# EAGLE design IoTKitV3th_small (EAGLE 9.5.2)
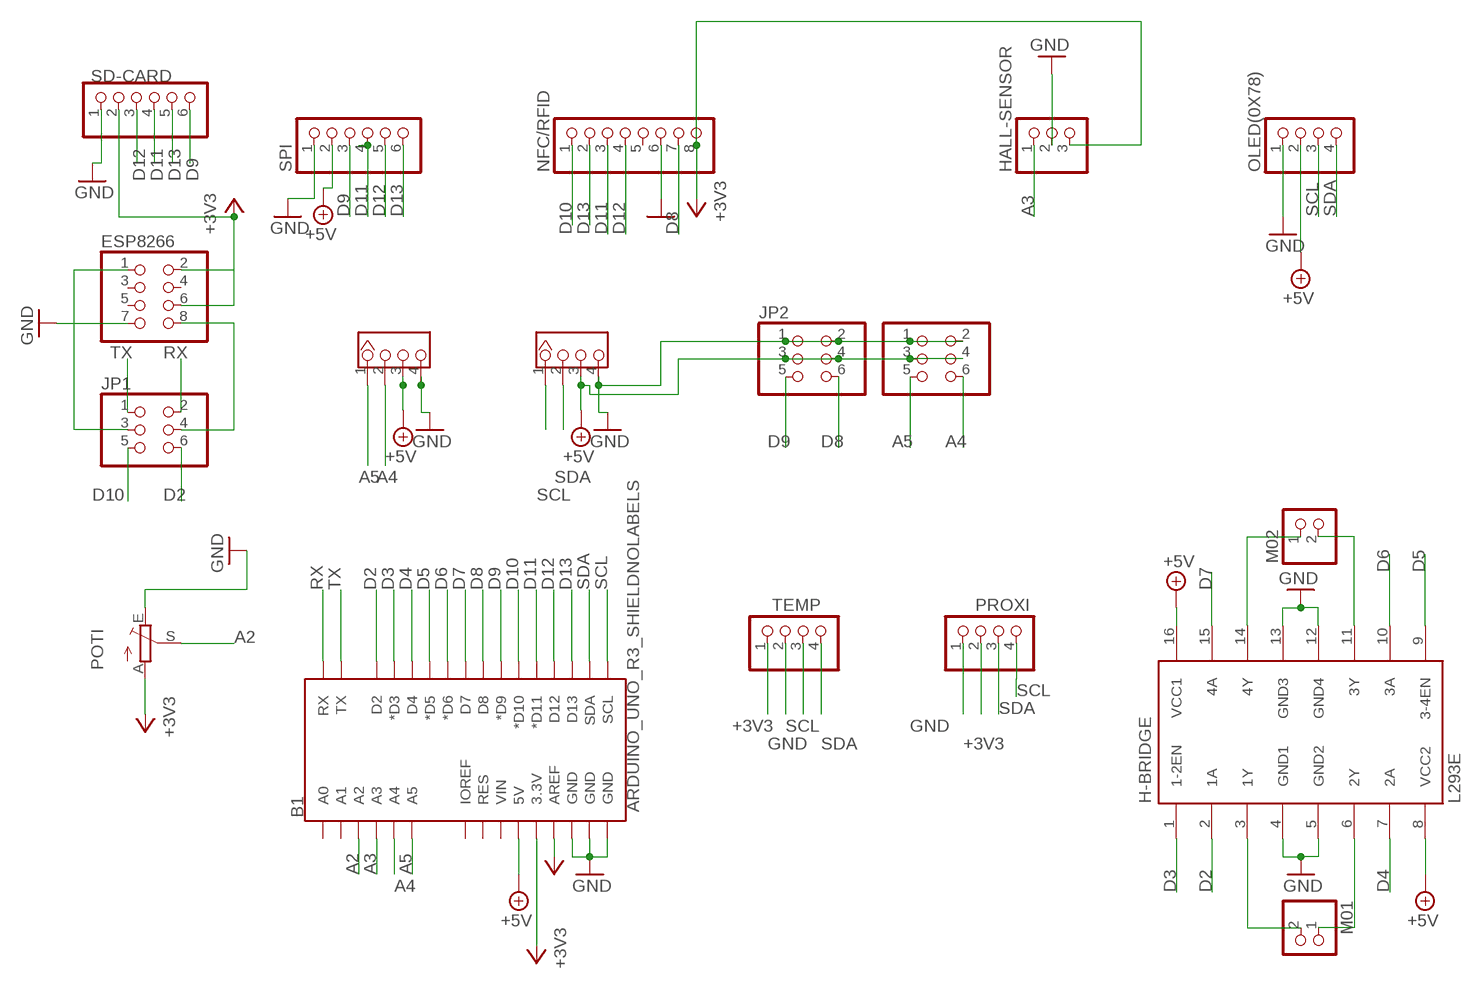
[diagram p0: schematic, sheet 1]

## Parts
B1  ARDUINO_UNO_R3_SHIELDNOLABELS  [UNO_R3_SHIELD_NOLABELS]
ESP8266  PINHD-2X4  [2X04]
H-BRIDGE  L293E  [DIL16]
HALL-SENSOR  PINHD-1X3  [1X03]
I2C  4P-2.0  GROVE-CONNECTOR-DIP(4P-2.0)  [HW4-2.0]
I2C1  I2C  GROVE-CONNECTOR-DIP(4P-2.0)  [HW4-2.0]
JP1  PINHD-2X3  [2X03]
JP2  PINHD-2X3  [2X03]
JP3  PINHD-2X3  [2X03]
M01  PINHD-1X2  [1X02]
M02  PINHD-1X2  [1X02]
NFC/RFID  PINHD-1X8  [1X08]
OLED(0X78)  PINHD-1X4  [1X04]
POTI  TRIM_EU-B25P  [B25P]
PROXI  PINHD-1X4  [1X04]
SD-CARD  PINHD-1X6  [1X06]
SPI  PINHD-1X6  [1X06]
TEMP  TEMP  PINHD-1X4  [1X04]

## Nets
+3V3: B1.3.3V B1.AREF ESP8266.2 ESP8266.6 HALL-SENSOR.3 NFC/RFID.8 POTI.A PROXI.2 SD-CARD.2 TEMP.1
+5V: B1.5V H-BRIDGE.8(VCC2) H-BRIDGE.16(VCC1) I2C1.3 I2C.3 JP2.3 JP2.4 JP3.3 JP3.4 OLED(0X78).2 SPI.2
A2: B1.A2 POTI.S
A3: B1.A3 HALL-SENSOR.1
A4: B1.A4 I2C.2 JP3.6
A5: B1.A5 I2C.1 JP3.5
D2: B1.D2 H-BRIDGE.2(1A) JP1.6
D3: B1.D3(*D3) H-BRIDGE.1(1-2EN)
D4: B1.D4 H-BRIDGE.7(2A)
D5: B1.D5(*D5) H-BRIDGE.9(3-4EN)
D6: B1.D6(*D6) H-BRIDGE.10(3A)
D7: B1.D7 H-BRIDGE.15(4A)
D8: B1.D8 JP2.6 NFC/RFID.7
D9: B1.D9(*D9) JP2.5 SD-CARD.6 SPI.3
D10: B1.D10(*D10) JP1.5 NFC/RFID.1
D11: B1.D11(*D11) NFC/RFID.3 SD-CARD.4 SPI.4
D12: B1.D12 NFC/RFID.4 SD-CARD.3 SPI.5
D13: B1.D13 NFC/RFID.2 SD-CARD.5 SPI.6
GND: B1.GND@0(GND) B1.GND@1(GND) B1.GND@2(GND) ESP8266.7 H-BRIDGE.4(GND1) H-BRIDGE.5(GND2) H-BRIDGE.12(GND4) H-BRIDGE.13(GND3) HALL-SENSOR.2 I2C1.4 I2C.4 JP2.1 JP2.2 JP3.1 JP3.2 NFC/RFID.6 OLED(0X78).1 POTI.E PROXI.1 SD-CARD.1 SPI.1 TEMP.2
M01: H-BRIDGE.6(2Y) M01.1
N$8: ESP8266.1 JP1.3
N$9: ESP8266.8 JP1.4
N$38: H-BRIDGE.14(4Y) M02.1
N$39: H-BRIDGE.11(3Y) M02.2
N$40: H-BRIDGE.3(1Y) M01.2
RX: B1.RX JP1.2
SCL: B1.SCL I2C1.1 OLED(0X78).3 PROXI.4 TEMP.3
SDA: B1.SDA I2C1.2 OLED(0X78).4 PROXI.3 TEMP.4
TX: B1.TX JP1.1
Unconnected: B1.A0 B1.A1 B1.IOREF B1.RES B1.VIN ESP8266.3 ESP8266.4 ESP8266.5 NFC/RFID.5

## Library data of the parts
B1 = SparkFun-Boards:ARDUINO_UNO_R3_SHIELD: Arduino R3 Shield Footprint Shield form compatible with the Arduino Uno R3. SparkFun Products: MG2639 Cellular Shield <https://www.sparkfun.com/products/13120> MIDI Shield <https://www.sparkfun.com/products/12898> R3 Stackable Headers Kit <https://www.sparkfun.com/products/11417>
ESP8266 = pinhead:PINHD-2X4: PIN HEADER
H-BRIDGE = texas:L293E: TI DEVICE; MF: Arrow Electronics; MPN: L293E; OC_FARNELL: 1467711; OC_NEWARK: 89K0732
HALL-SENSOR = pinhead:PINHD-1X3: PIN HEADER
I2C = Seeed-Connector:GROVE-CONNECTOR-DIP(4P-2.0): 320110033
I2C1 = Seeed-Connector:GROVE-CONNECTOR-DIP(4P-2.0): 320110033; VALUE: 4P-2.0
JP1-JP3 = pinhead:PINHD-2X3: PIN HEADER
M01 M02 = pinhead:PINHD-1X2: PIN HEADER
NFC/RFID = pinhead:PINHD-1X8: PIN HEADER
OLED(0X78) PROXI TEMP = pinhead:PINHD-1X4: PIN HEADER
POTI = pot:TRIM_EU-: POTENTIOMETER
SD-CARD SPI = pinhead:PINHD-1X6: PIN HEADER

## Board
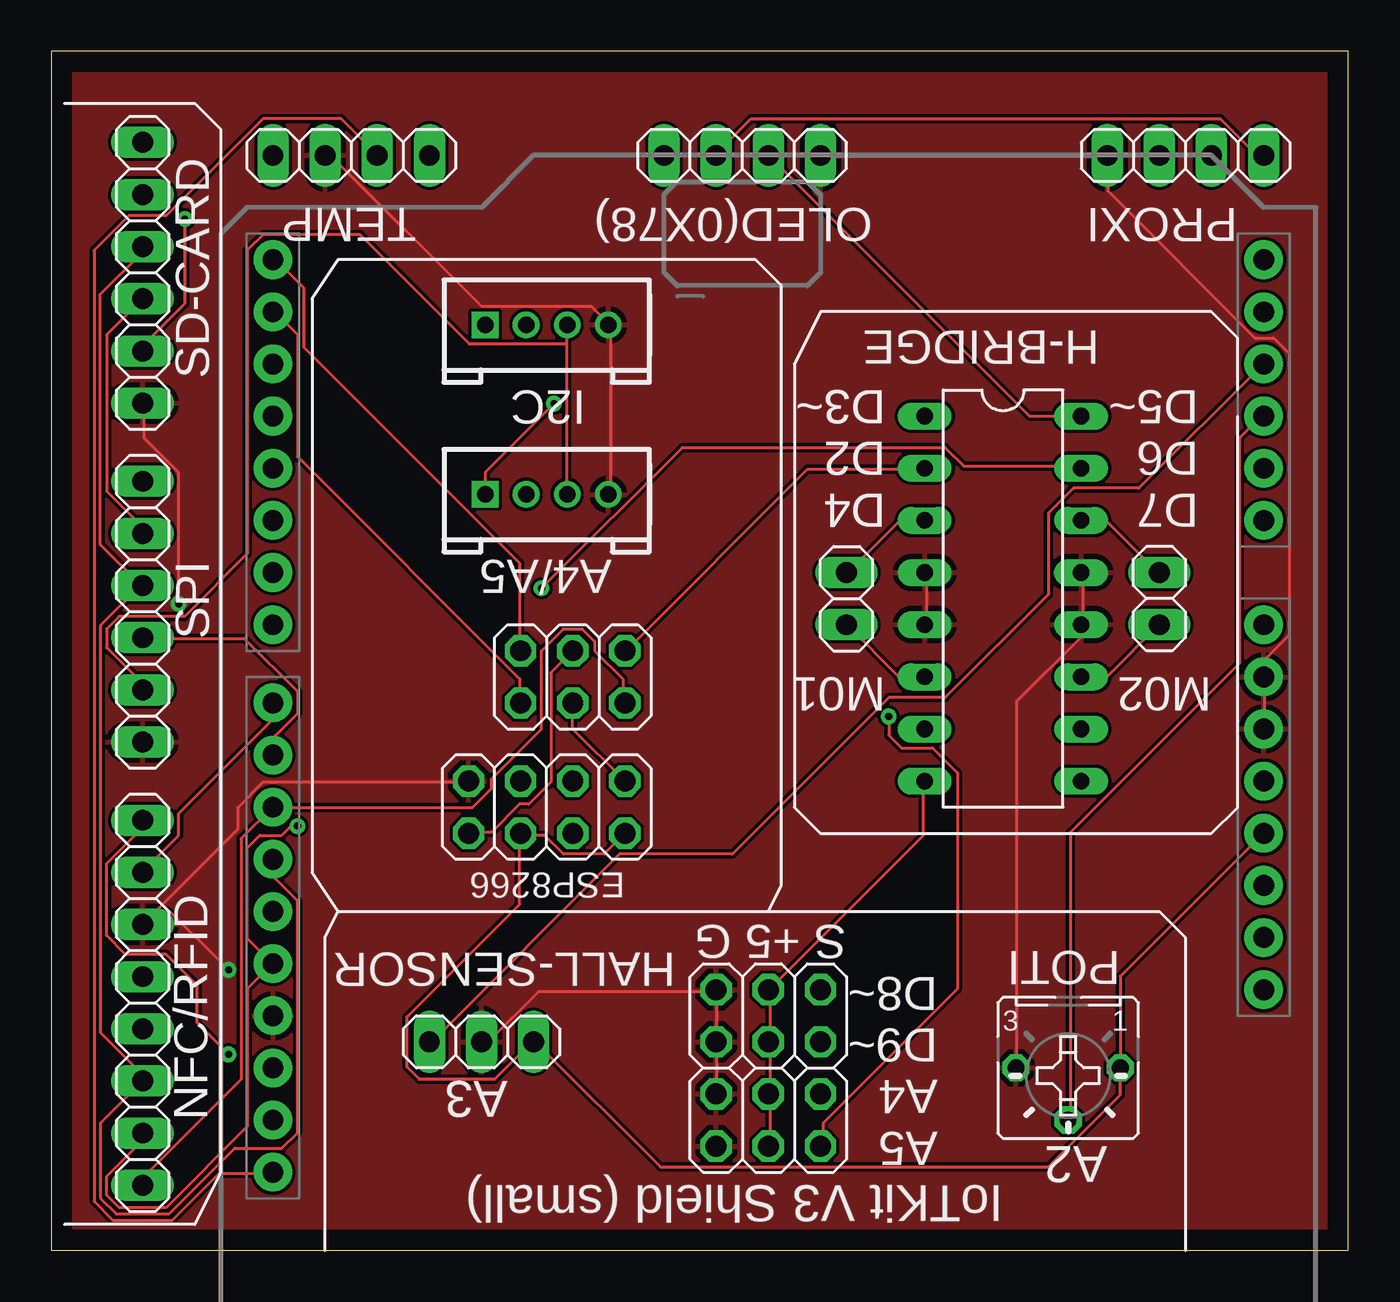
[diagram p1: board, top side]
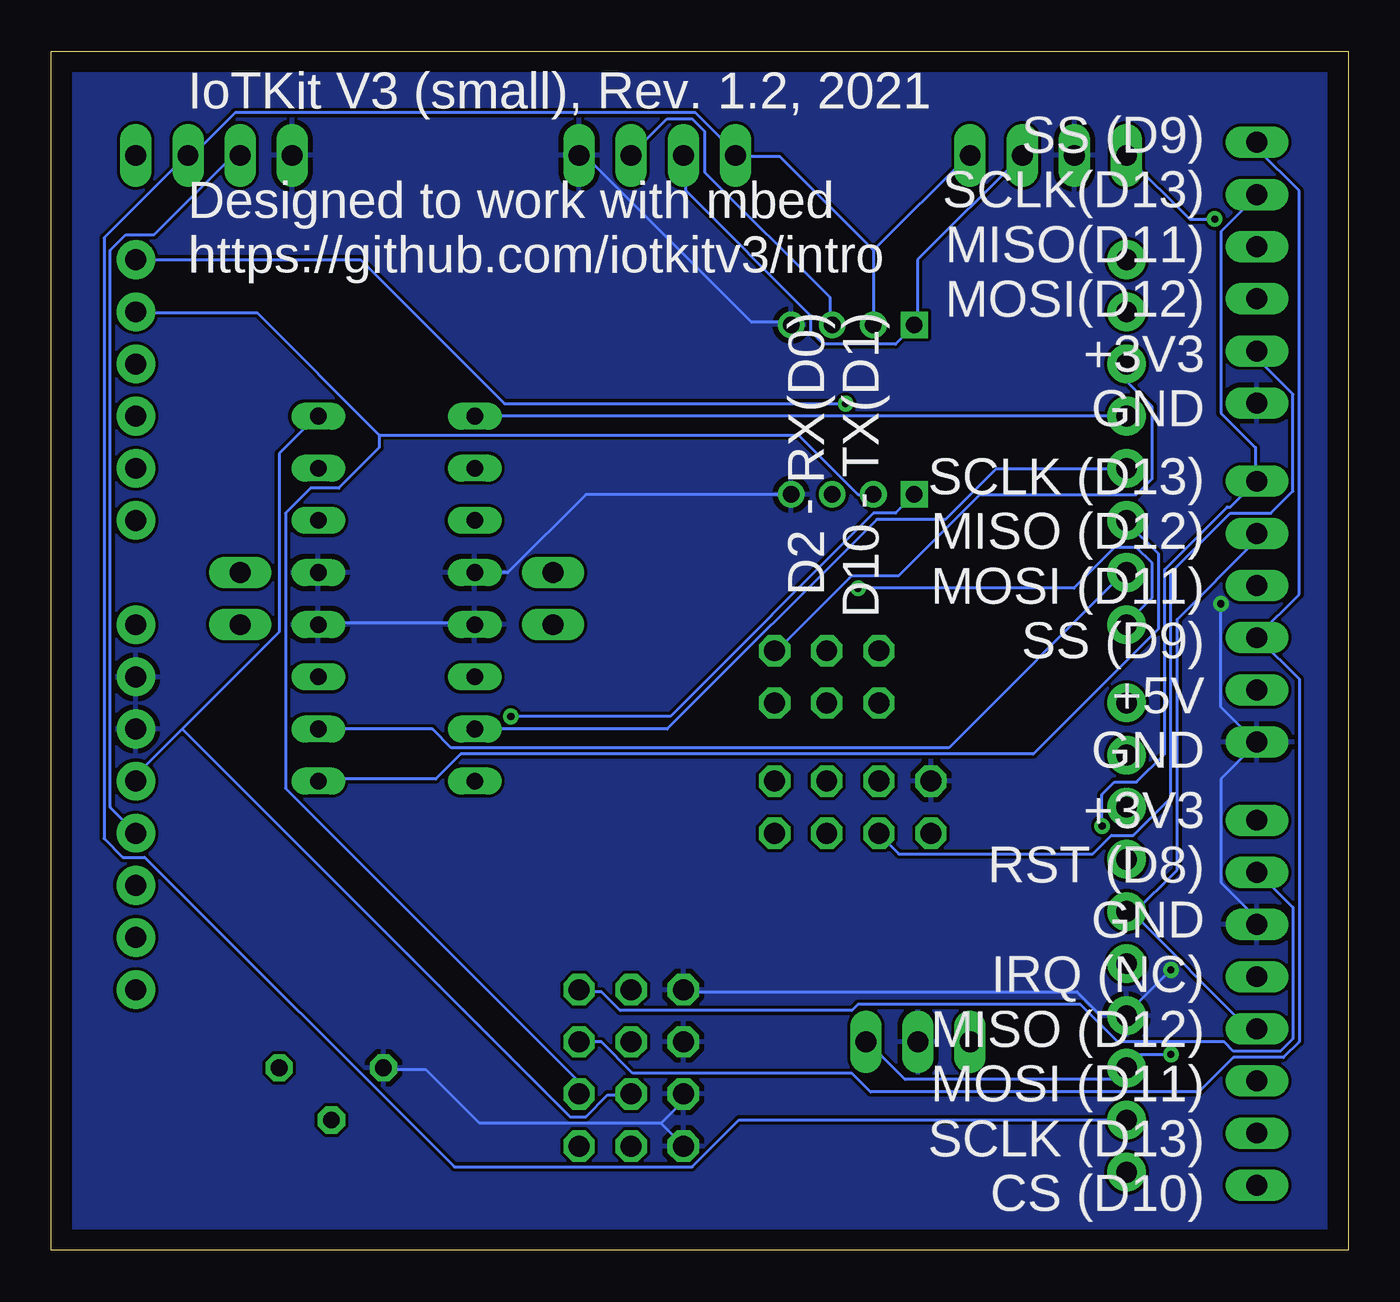
[diagram p2: board, bottom side, seen from below]

Size 63.17 x 58.41 mm. Coordinates in mm from the lower left corner, seen from the top.
Outline: 0,0 63.17,0 63.17,58.41 0,58.41 0,0
Copper layers (1*16): Top 0.035mm / dielectric 1.5mm / Bottom 0.035mm
Design rules "default": minimum track width 6mil, minimum drill 0.35mm, track to track 6mil, track to pad 6mil, pad to pad 6mil, via to via 6mil, smd to smd 6mil, copper to edge 40mil, drill to drill 6mil, minimum pad ring 10mil, minimum via ring 8mil, stop-mask expansion 4mil, vias tented up to drill 0mil, thermal gap 10mil

### Footprints (pad centres in the part's own frame; a part is rotated, then mirrored left to right if it is on the bottom)
UNO_R3_SHIELD_NOLABELS = drill 1.016 pad 1.88: 3.3V 24.13,-3.81; 5V 24.13,-1.27; A0 24.13,11.43; A1 24.13,13.97; A2 24.13,16.51; A3 24.13,19.05; A4 24.13,21.59; A5 24.13,24.13; AREF -24.13,-15.24; D2 -24.13,19.05; D3 -24.13,16.51; D4 -24.13,13.97; D5 -24.13,11.43; D6 -24.13,8.89; D7 -24.13,6.35; D8 -24.13,2.54; D9 -24.13,0; D10 -24.13,-2.54; D11 -24.13,-5.08; D12 -24.13,-7.62; D13 -24.13,-10.16; GND@0 24.13,1.27; GND@1 24.13,3.81; GND@2 -24.13,-12.7; IOREF 24.13,-8.89; NC 24.13,-11.43; RES 24.13,-6.35; RX -24.13,24.13; SCL -24.13,-20.32; SDA -24.13,-17.78; TX -24.13,21.59; VIN 24.13,6.35
2X04 = drill 1.016 octagon: 1 -3.81,-1.27; 2 -3.81,1.27; 3 -1.27,-1.27; 4 -1.27,1.27; 5 1.27,-1.27; 6 1.27,1.27; 7 3.81,-1.27; 8 3.81,1.27
DIL16 = drill 0.813 long: 1 -8.89,-3.81; 2 -6.35,-3.81; 3 -3.81,-3.81; 4 -1.27,-3.81; 5 1.27,-3.81; 6 3.81,-3.81; 7 6.35,-3.81; 8 8.89,-3.81; 9 8.89,3.81; 10 6.35,3.81; 11 3.81,3.81; 12 1.27,3.81; 13 -1.27,3.81; 14 -3.81,3.81; 15 -6.35,3.81; 16 -8.89,3.81
1X03 = drill 1.016 long: 1 -2.54,0; 2 0,0; 3 2.54,0
HW4-2.0 = drill 0.8 pad 1.27 square: 1 -3,0 | drill 0.8 pad 1.27: 2 -1,0; 3 1,0; 4 3,0
2X03 = drill 1.016 octagon: 1 -2.54,-1.27; 2 -2.54,1.27; 3 0,-1.27; 4 0,1.27; 5 2.54,-1.27; 6 2.54,1.27
1X02 = drill 1.016 long: 1 -1.27,0; 2 1.27,0
1X08 = drill 1.016 long: 1 -8.89,0; 2 -6.35,0; 3 -3.81,0; 4 -1.27,0; 5 1.27,0; 6 3.81,0; 7 6.35,0; 8 8.89,0
1X04 = drill 1.016 long: 1 -3.81,0; 2 -1.27,0; 3 1.27,0; 4 3.81,0
B25P = drill 0.813 octagon: A -2.54,0; E 2.54,0; S 0,2.54
1X06 = drill 1.016 long: 1 -6.35,0; 2 -3.81,0; 3 -1.27,0; 4 1.27,0; 5 3.81,0; 6 6.35,0

### Placement (x,y rotation side)
B1  34.92,24.13 0 top
ESP8266  24.13,21.59 180 top
H-BRIDGE  46.35,31.75 270 top
HALL-SENSOR  20.96,10.16 0 top
I2C  24.13,36.83 0 top
I2C1  24.13,45.08 0 top
JP1  25.4,27.94 0 top
JP2  34.92,11.43 0 top
JP3  34.92,6.35 0 top
M01  38.73,31.75 90 top
M02  53.97,31.75 270 top
NFC/RFID  4.45,12.07 90 top
OLED(0X78)  33.65,53.34 180 top
POTI  49.53,8.89 180 top
PROXI  55.24,53.34 0 top
SD-CARD  4.45,47.62 90 top
SPI  4.45,31.11 90 top
TEMP  14.61,53.34 0 top

### Tracks (layer width: path | path; a pad name or v marks a point on that pad's centre or on a via)
+3V3  (via drill 0.35)
  Top 0.152: B1.3.3V 58.93,20.22 52.07,13.36 POTI.A 52.07,7.57 48.56,4.06 29.67,4.06 23.57,10.16 HALL-SENSOR.3 23.42,10.16 21.59,8.33 17.93,8.33 17.32,8.94 17.32,11.38 22.81,16.87 22.81,20.22 ESP8266.6 22.96,20.22 24.03,20.22 24.94,19.3 26.92,19.3 ESP8266.2 | v6.5,50.24 6.5,46.13 4.52,44.14 4.52,43.84 SD-CARD.2 | v8.64,9.55 7.11,11.07 7.11,12.9 5.59,14.43 3.61,14.43 2.69,15.34 2.69,18.85 4.37,20.52 4.37,20.83 NFC/RFID.8
  Bottom 0.152: PROXI.2 54.05,53.29 54.36,53.29 58.17,49.48 59.54,49.48 60.3,48.72 60.3,21.59 59.08,20.37 B1.3.3V | v6.5,50.24 7.72,50.24 10.77,53.29 TEMP.1 | v8.64,9.55 10.16,9.55 10.77,8.94 B1.AREF 10.92,8.79 11.38,8.33 21.59,8.33 23.42,10.16 HALL-SENSOR.3 | SD-CARD.2 4.37,43.69 4.37,43.38 2.69,41.71 2.69,36.98 3.76,35.92 5.74,35.92 8.64,33.02 8.64,22.05 10.46,20.22 11.53,20.22 12.45,19.3 21.89,19.3 22.81,20.22 ESP8266.6
+5V
  Top 0.152: 25.09,44.14 25.09,45.06 I2C1.3 | 25.09,44.14 25.09,36.83 I2C.3 | 25.09,44.14 20.37,44.14 15.04,49.48 10.31,49.48 9.55,48.72 9.55,33.93 6.5,30.89 3.3,30.89 2.69,30.28 2.69,29.36 4.37,27.69 4.37,27.38 SPI.2 | JP3.3 35,5.13 35,7.57 JP3.4 35,7.72 35,10.16 | H-BRIDGE.8 42.47,22.81 42.47,20.22 35,12.75 JP2.4 35,12.6 35,10.16 | 35,10.16 JP2.3 | H-BRIDGE.16 47.65,40.64 35,53.29 OLED(0X78).2
  Bottom 0.152: 56.79,25.4 52.07,30.12 52.07,38.81 50.24,40.64 H-BRIDGE.16 | 56.79,25.4 58.93,23.27 58.93,22.96 B1.5V | 56.79,25.4 37.9,6.5 37.13,6.5 36.07,7.57 35,7.57 JP3.4 | I2C1.3 25.25,45.21 25.25,46.43 31.34,52.53 31.34,54.51 31.95,55.12 33.17,55.12 34.85,53.44 OLED(0X78).2
A2
  Top 0.152: POTI.S 49.63,6.35 49.63,20.37 57.86,28.6 57.86,39.57 58.93,40.64 B1.A2
A3
  Top 0.152: HALL-SENSOR.1 18.54,10.16 27.69,19.3 33.17,19.3 40.79,26.92 43.54,26.92 48.56,31.95 48.56,35.92 49.78,37.13 52.98,37.13 58.93,43.08 B1.A3
A4
  Bottom 0.152: I2C.2 23.88,36.83 26.77,39.73 47.19,39.73 | 47.19,39.73 53.14,45.67 58.93,45.67 B1.A4 | 47.19,39.73 47.19,39.12 49.17,37.13 50.55,37.13 51.76,35.92 51.76,22.5 37.59,8.33 37.59,7.72 JP3.6
A5  (via drill 0.35)
  Top 0.152: v24.49,41.25 21.13,37.9 I2C.1 | v40.79,26.01 40.79,25.09 41.4,24.49 42.93,24.49 44.14,23.27 44.14,12.75 37.59,6.2 37.59,5.13 JP3.5
  Bottom 0.152: v24.49,41.25 41.1,41.25 48.11,48.26 B1.A5 | v40.79,26.01 33.02,26.01 23.11,35.92 22.05,35.92 I2C.1
D2
  Top 0.152: H-BRIDGE.2 42.47,38.05 36.83,38.05 27.99,29.21 JP1.6
  Bottom 0.152: B1.D2 10.77,43.08 10.77,42.32 9.55,41.1 9.55,37.59 10.31,36.83 17.93,36.83 21.89,32.87 24.18,32.87 27.84,29.21 JP1.6
D3
  Bottom 0.152: B1.D3 H-BRIDGE.1
D4
  Bottom 0.152: H-BRIDGE.7 33.17,25.4 22.96,35.61 19.61,35.61 17.17,38.05 10.92,38.05 B1.D4
D5
  Bottom 0.152: H-BRIDGE.9 50.09,22.96 44.45,22.96 43.23,24.18 15.34,24.18 9.25,30.28 9.25,33.93 10.77,35.46 B1.D5
D6
  Bottom 0.152: H-BRIDGE.10 44.6,25.4 43.69,24.49 19.46,24.49 10.92,33.02 B1.D6
D7  (via drill 0.35)
  Top 0.152: v23.88,32.26 30.73,39.12 43.54,39.12 44.45,38.2 50.09,38.2 H-BRIDGE.15
  Bottom 0.152: v23.88,32.26 13.36,32.26 11.38,34.24 10.31,34.24 9.55,33.48 9.55,31.8 10.77,30.58 B1.D7
D8
  Top 0.152: B1.D8 10.77,26.62 10.77,25.86 6.2,21.29 6.2,20.22 4.52,18.54 NFC/RFID.7
  Bottom 0.152: JP2.6 37.44,12.6 36.37,12.6 35.46,11.68 24.18,11.68 23.88,11.99 13.06,11.99 11.23,10.16 6.04,10.16 5.59,9.7 3.3,9.7 2.69,10.31 2.69,16.71 4.37,18.39 NFC/RFID.7
D9
  Top 0.152: B1.D9 10.92,24.18 10.92,25.09 11.99,26.16 11.99,27.23 9.4,29.82 4.52,29.82 SPI.3
  Bottom 0.152: JP2.5 36.37,10.16 34.85,8.64 24.18,8.64 23.27,7.72 7.26,7.72 5.59,9.4 3.15,9.4 2.39,10.16 2.39,27.84 4.37,29.82 SPI.3 4.37,29.97 2.39,31.95 2.39,51.61 4.37,53.59 4.37,53.9 SD-CARD.6
D10
  Top 0.152: NFC/RFID.1 4.52,3.3 4.52,3.61 9.25,8.33 9.25,20.07 10.77,21.59 B1.D10 20.52,21.59 21.44,22.5 21.44,22.96 23.88,25.4 23.88,29.21 24.94,30.28 25.86,30.28 26.47,29.67 26.47,29.21 27.84,27.84 27.84,26.77 JP1.5
D11
  Top 0.152: 4.37,32.41 2.39,30.43 2.39,10.62 4.37,8.64 4.37,8.33 NFC/RFID.3 2.39,6.2 2.39,2.54 3.15,1.78 5.74,1.78 8.94,4.98 11.23,4.98 11.99,5.74 11.99,17.02 10.92,18.09 10.92,19 B1.D11 | 4.37,32.41 2.39,34.39 2.39,46.58 4.37,48.56 4.37,48.87 SD-CARD.4 | 4.37,32.41 SPI.4
D12
  Top 0.152: SD-CARD.3 2.69,44.6 2.69,36.98 4.37,35.31 4.37,35 SPI.5
  Bottom 0.152: 10.46,16.41 4.98,10.92 4.52,10.92 NFC/RFID.4 | 10.46,16.41 10.77,16.41 B1.D12 10.46,16.41 | 10.46,16.41 8.33,18.54 8.33,30.73 4.52,34.54 4.52,34.85 SPI.5
D13  (via drill 0.35)
  Top 0.152: 10.77,13.97 9.55,12.75 9.55,6.04 5.59,2.08 3.3,2.08 2.69,2.69 2.69,3.61 4.37,5.28 4.37,5.59 NFC/RFID.2 | v11.99,20.68 11.68,20.68 11.23,20.22 10.16,20.22 9.55,19.61 9.55,15.19 10.77,13.97 | 10.77,13.97 B1.D13
  Bottom 0.152: SD-CARD.5 4.52,51.31 6.2,49.63 6.2,40.79 4.52,39.12 4.52,37.59 SPI.6 4.52,37.44 5.74,36.22 5.89,36.22 8.94,33.17 8.94,24.18 10.31,22.81 11.38,22.81 11.99,22.2 v11.99,20.68
GND  (via drill 0.35)
  Top 0.152: B1.GND@0 59.08,25.4 59.08,27.84 B1.GND@1 59.08,27.99 59.08,28.75 60.3,29.97 60.3,43.69 59.54,44.45 58.62,44.45 51.46,51.61 51.46,53.29 PROXI.1 51.31,53.29 37.59,53.29 OLED(0X78).1 | H-BRIDGE.5 42.62,30.58 42.62,33.02 H-BRIDGE.4 | H-BRIDGE.13 50.24,33.02 50.24,30.58 H-BRIDGE.12 50.09,30.43 50.09,29.82 47.04,26.77 47.04,8.94 POTI.E | I2C.4 27.23,36.83 27.23,45.06 I2C1.4 27.08,45.21 26.31,45.97 20.98,45.97 13.67,53.29 13.36,53.29 TEMP.2 | v6.2,31.5 6.2,37.9 4.52,39.57 4.52,41.25 SD-CARD.1 | NFC/RFID.6 5.44,16.87 | 5.44,16.87 9.09,20.52 9.09,21.59 10.31,22.81 20.22,22.81 ESP8266.7 | HALL-SENSOR.2 21.29,10.16 23.72,12.6 32.26,12.6 JP2.2 32.41,12.6 32.41,10.16 | 32.41,10.16 32.41,7.72 JP3.2 | 32.41,10.16 JP2.1 | v8.64,13.67 5.44,16.87
  Bottom 0.152: H-BRIDGE.5 42.62,30.58 50.09,30.58 H-BRIDGE.12 | H-BRIDGE.4 40.95,33.02 37.13,36.83 I2C.4 | OLED(0X78).1 37.44,53.29 37.13,53.29 29.06,45.21 27.23,45.21 I2C1.4 | NFC/RFID.6 4.52,15.95 4.52,16.26 6.2,17.93 6.2,22.96 4.52,24.64 SPI.1 4.52,24.79 6.2,26.47 v6.2,31.5 | 33.48,6.2 42.32,6.2 44.91,8.79 46.89,8.79 POTI.E | 33.48,6.2 32.41,5.13 JP3.1 | 33.48,6.2 32.41,7.26 32.41,7.57 JP3.2 | JP2.2 32.26,12.6 13.21,12.6 12.14,11.53 10.92,11.53 B1.GND@2 10.77,11.53 v8.64,13.67
  pour Top: -0.64,58.42 -0.64,-0.64 63.5,-0.64 63.5,59.05 0,59.05
  pour Bottom: 0,58.42 0,0 63.5,0 63.5,58.42
M01
  Top 0.152: H-BRIDGE.6 42.47,27.99 41.25,27.99 38.81,30.43 M01.1
N$8
  Top 0.152: JP1.3 25.4,25.4 ESP8266.1
N$9
  Top 0.152: JP1.4 24.33,28.14 24.33,22.81 23.27,21.74 22.81,21.74 21.44,20.37 20.37,20.37 ESP8266.8
N$38
  Top 0.152: H-BRIDGE.14 50.24,35.46 51.46,35.46 53.9,33.02 M02.1
N$39
  Top 0.152: H-BRIDGE.11 50.24,27.99 51.46,27.99 53.9,30.43 M02.2
N$40
  Top 0.152: H-BRIDGE.3 42.47,35.46 41.25,35.46 38.81,33.02 M01.2
RX
  Top 0.152: JP1.2 22.81,29.21 22.81,33.48 12.29,43.99 12.29,46.89 10.92,48.26 B1.RX
SCL
  Top 0.152: PROXI.4 58.93,53.44 58.62,53.44 56.95,55.12 34.09,55.12 32.41,53.44 OLED(0X78).3 | B1.SCL 10.77,3.76 8.18,3.76 5.89,1.47 3,1.47 2.08,2.39 2.08,48.72 3.76,50.39 5.59,50.39 10.31,55.12 14.12,55.12 15.8,53.44 TEMP.3
  Bottom 0.152: TEMP.3 15.95,53.29 20.98,48.26 20.98,45.21 I2C1.1 21.13,45.06 22.05,44.14 25.55,44.14 26.16,44.75 26.16,45.52 32.26,51.61 32.26,53.29 OLED(0X78).3
SDA
  Bottom 0.152: 23.11,48.72 23.11,45.21 I2C1.2 | 23.11,48.72 18.54,53.29 TEMP.4 | 23.11,48.72 27.69,53.29 29.82,53.29 OLED(0X78).4 29.82,53.44 31.8,55.42 54.2,55.42 56.18,53.44 56.49,53.44 PROXI.3 56.64,53.29 60.6,49.33 60.6,20.07 59.69,19.15 58.62,19.15 43.54,4.06 31.95,4.06 29.67,6.35 B1.SDA
TX
  Top 0.152: JP1.1 22.81,26.77 22.81,27.84 11.99,38.66 11.99,44.6 10.92,45.67 B1.TX

### Text on the board
tNames: TEMP | PROXI | I2C | D4 / D2 / D3~ | D4 / D2 / D3~ | D7 / D6 / D5~ | A4/A5 | S +5 G | A5 / A4 / D9~ / D8~ | A3 | A2 | IoTKit V3 Shield (small)
bNames: SS (D9) / SCLK(D13) / MISO(D11) / MOSI(D12) / +3V3 / GND | IoTKit V3 (small), Rev. 1.2, 2021 / / Designed to work with mbed / https://github.com/iotkitv3/intro | D2 - RX(D0) / D10 - TX(D1) | SCLK (D13) / MISO (D12) / MOSI (D11) / SS (D9) / +5V / GND | +3V3 / RST (D8) / GND / IRQ (NC) / MISO (D12) / MOSI (D11) / SCLK (D13) / CS (D10)